# Altium schematic sheet 220uf_35V.schdoc
size 49 x 28 mm
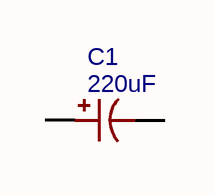
[diagram p0: 220uf_35V.schdoc]

## Parts
C1  220uF  [CAP-SMD_BD10.0-L10.3-W10.3-LS11.0-FD]

## Nets

Not connected (* = marked no-connect by the designer): C1 1 2

## Library data of the parts
C1 = 220uF: BOM_Manufacturer: KNSCHA(科尼盛); BOM_Manufacturer Part: RVT220UF50V67RV0021; nameAlias: Capacitance; Contributor: LCSC; BOM_Supplier: LCSC; BOM_Supplier Part: C2887271; BOM_JLCPCB Part Class: Extended Part; spicePre: C; spiceSymbolName: RVT220UF50V67RV0021